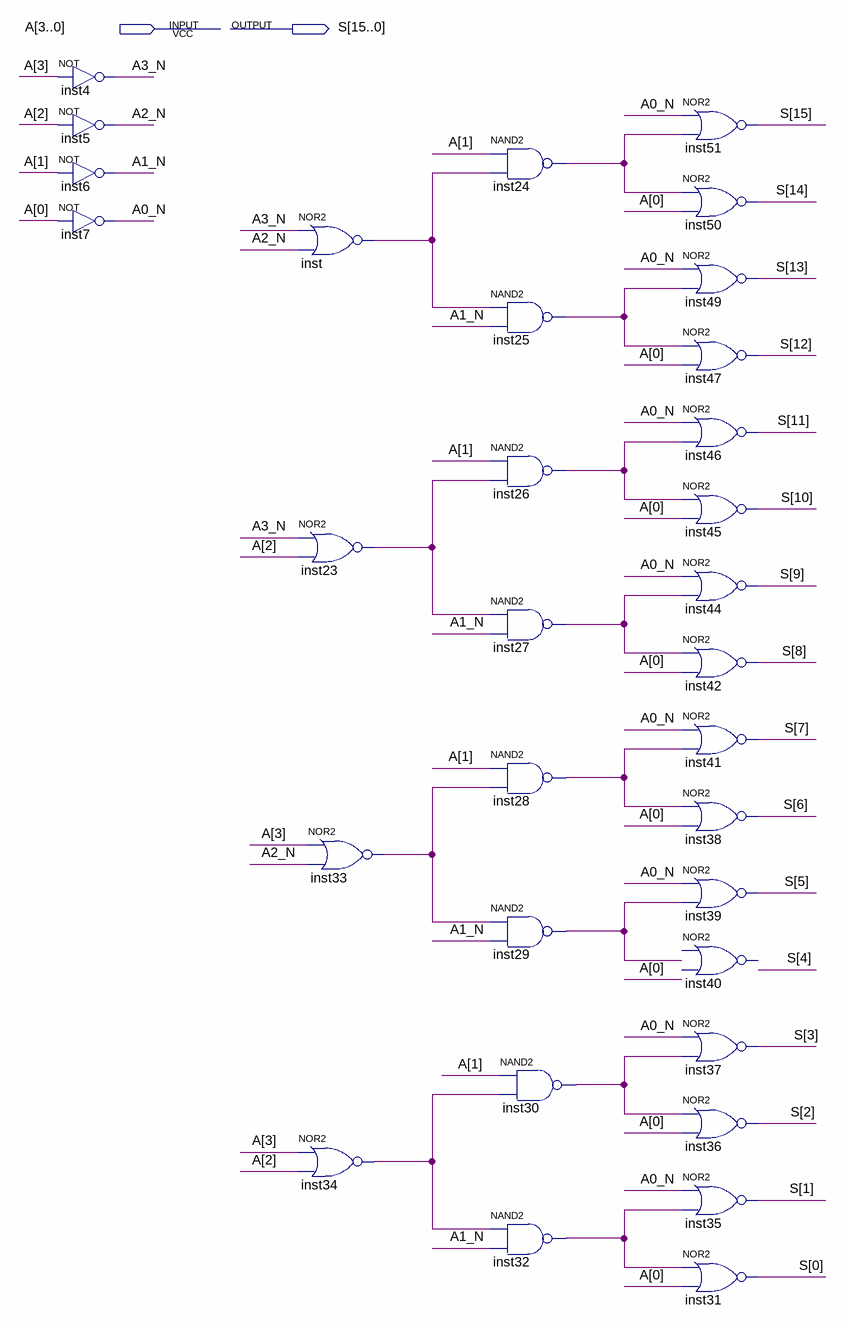
[diagram p0: schematic sheet]
// Quartus schematic decoder.bdf as structural Verilog: 32 symbols, 2 pins
module decoder (
  input  [3:0] A,
  output [15:0] S
);

  wire A0_N, A1_N, A2_N, A3_N, inst23_out, inst24_out, inst25_out, inst26_out, inst27_out, inst28_out,
       inst29_out, inst30_out, inst32_out, inst33_out, inst34_out, inst_out;

  not inst4 (A3_N, A[3]);
  not inst5 (A2_N, A[2]);
  not inst6 (A1_N, A[1]);
  not inst7 (A0_N, A[0]);
  nor inst (inst_out, A3_N, A2_N);
  nor inst23 (inst23_out, A3_N, A[2]);
  nor inst33 (inst33_out, A[3], A2_N);
  nor inst34 (inst34_out, A[3], A[2]);
  nand inst24 (inst24_out, A[1], inst_out);
  nand inst25 (inst25_out, inst_out, A1_N);
  nand inst26 (inst26_out, A[1], inst23_out);
  nand inst27 (inst27_out, inst23_out, A1_N);
  nand inst28 (inst28_out, A[1], inst33_out);
  nand inst29 (inst29_out, inst33_out, A1_N);
  nand inst30 (inst30_out, A[1], inst34_out);
  nand inst32 (inst32_out, inst34_out, A1_N);
  nor inst51 (S[15], A0_N, inst24_out);
  nor inst50 (S[14], inst24_out, A[0]);
  nor inst49 (S[13], A0_N, inst25_out);
  nor inst47 (S[12], inst25_out, A[0]);
  nor inst46 (S[11], A0_N, inst26_out);
  nor inst45 (S[10], inst26_out, A[0]);
  nor inst44 (S[9], A0_N, inst27_out);
  nor inst42 (S[8], inst27_out, A[0]);
  nor inst41 (S[7], A0_N, inst28_out);
  nor inst38 (S[6], inst28_out, A[0]);
  nor inst39 (S[5], A0_N, inst29_out);
  // NOR2 inst40 is placed but not wired
  nor inst37 (S[3], A0_N, inst30_out);
  nor inst36 (S[2], inst30_out, A[0]);
  nor inst35 (S[1], A0_N, inst32_out);
  nor inst31 (S[0], inst32_out, A[0]);
endmodule
